# EasyEDA Pro project ProPrj_ESP32 Touchpad.epro, board PCB2
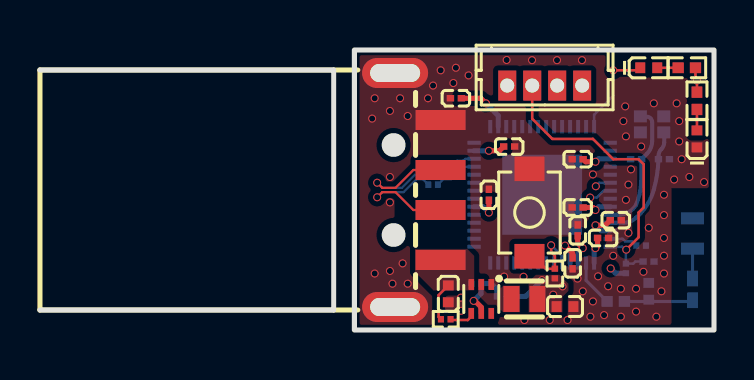
[diagram p9: board, top side]
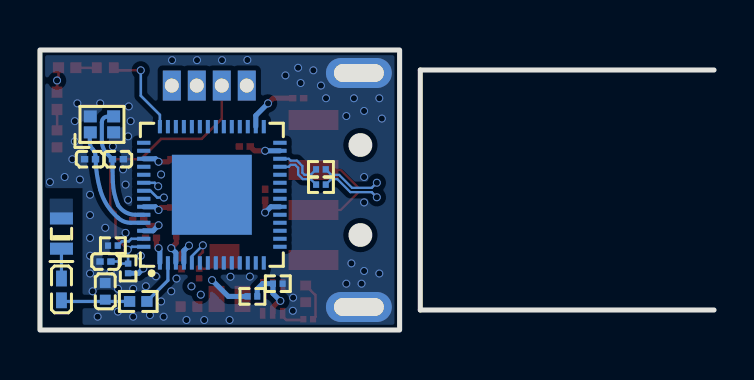
[diagram p10: board, bottom side, seen from below]

Outline 33.74 x 14 mm; copper layers: Top Layer, Inner1, Inner2, Bottom Layer. Coordinates in mm from the lower left corner of the outline.
Outline path: rectangle 15.74,14 33.74,0
Stack: Top Layer 0.035mm Outer layer thickness 1oz / Dielectric1 0.28mm 7628 RC49% 8.6mil / Inner1 0.035mm Inner layer thickness / Dielectric2 0.28mm 1.1mm H/HOZ Copper / Inner2 0.035mm Inner layer thickness / Dielectric3 0.28mm 7628 RC49% 8.6mil / Bottom Layer 0.035mm Outer layer thickness 1oz

## Design rules (mm)
net D-: D
net D+: D
net D_R+: D_R
net D_R-: D_R
spacing copperThickness1oz (default): track to track 0.102, other pairs 0.152 to 0.3
spacing copperThickness2oz: track to track 0.203, other pairs 0.152 to 0.3
track width copperThickness1oz (default): min 0.127, default 0.254, max 2.54
track width copperThickness2oz: min 0.203, default 0.254, max 2.54
differential pair differentialPair (default): width min 0.112, default 0.112, max 2.54; gap min 0.102, default 0.102
net GND uses copperRegion

## Placement (name value [footprint] x y rotation side)
ANT1  KH-1608-H08  [ANT-SMD_L1.7-W0.9]  32.66 4.82 270 bottom
C1  1.5pF  [C0402]  30.47 1.94 270 bottom
C2  22pF  [C0201]  31.23 8.54 0 bottom
C3  22pF  [C0201]  29.83 8.54 180 bottom
C4  1uF  [C0201]  20.82 11.59 180 top
C5  1uF  [C0201]  30.46 3.42 180 bottom
C6  100nF  [C0201]  22.47 6.76 90 top
C7  100nF  [C0201]  26.66 3.33 270 top
C8  100nF  [C0201]  26.91 4.98 90 top
C9  100nF  [C0201]  28.18 4.6 0 top
C10  100nF  [C0201]  28.82 5.49 0 top
C11  100nF  [C0201]  26.91 8.54 180 top
C12  100nF  [C0201]  26.91 6.13 180 top
C13  100nF  [C0201]  23.48 9.17 0 top
C14  22uF  [C0402]  26.28 1.17 180 top
C15  10uF  [C0402]  20.44 1.81 90 top
H1  WAFER-MX1.25-4PZZ  [CONN-TH_4P-P1.25_WAFER-MX1.25-4PZZ]  25.26 12.22 180 top
L1  10nH  [L0402-RD]  32.66 2.03 270 bottom
L2  2.2uH  [IND-SMD_L2.0-W1.2_FTC201210S]  24.25 1.55 0 top
LED1  NCD0402R1  [LED0402-RD]  30.47 13.11 0 top
LED2  NCD0402R1  [LED0402-RD]  32.88 9.56 90 top
R1  0Ω  [R0402_1]  28.82 1.43 180 bottom
R2  22Ω  [R0201]  19.67 7.27 180 bottom
R3  22Ω  [R0201]  19.67 8.03 180 bottom
R4  10kΩ  [R0201]  29.33 3.08 270 bottom
R5  10kΩ  [R0201]  25.77 2.82 270 top
R6  10kΩ  [R0201]  30.09 4.22 0 bottom
R7  10kΩ  [R0402]  32.37 13.11 0 top
R8  10kΩ  [R0402]  32.88 11.46 90 top
R9  10kΩ  [R0201]  20.31 0.54 180 top
R10  100kΩ  [R0201]  23.1 1.68 0 bottom
R11  22kΩ  [R0201]  21.83 2.32 0 bottom
SW1  TS342A2P 160gf 021  [KEY-SMD_L3.9-W3.0-LS5.0]  24.5 5.87 270 top
U1  2.4GHz  [QFN-56_L7.0-W7.0-P0.40-TL-EP4.6]  25.13 6.76 90 bottom
U2  TLV62585PDRLR  [SOT-563_L1.6-W1.2-P0.50-LS1.6-BL]  22.09 1.55 180 top
USB1  USB-U203-BDS  [USB-SMD_USB-U203-BDS]  18.91 7 270 top
X1  40MHz  [CRYSTAL-SMD_4P-L1.6-W1.2-BL]  30.63 10.28 180 bottom

## Footprints (pads in the part's own frame, mm; a bottom-side part is the same pattern mirrored in y, then rotated)
ANT-SMD_L1.7-W0.9
  rect 0.6x1.15 smd: 1(-0.756,0) 2(0.756,0)
C0201
  rect 0.368x0.324 smd: 1(-0.275,0) 2(0.275,0)
C0402
  rect 0.5x0.54 smd: 1(-0.42,0) 2(0.42,0)
CONN-TH_4P-P1.25_WAFER-MX1.25-4PZZ
  rect 0.9x1.5 hole 0.7: 1(1.875,0) 2(0.625,0) 3(-0.625,0) 4(-1.875,0)
CRYSTAL-SMD_4P-L1.6-W1.2-BL
  rect 0.65x0.6 smd: 1(-0.584,-0.4) 2(0.584,-0.4) 3(0.584,0.4) 4(-0.584,0.4)
IND-SMD_L2.0-W1.2_FTC201210S
  rect 0.8x1.3 smd: 1(-0.65,0) 2(0.65,0)
KEY-SMD_L3.9-W3.0-LS5.0
  rect 1.23x1.5 smd: 1(-2.185,0) 2(2.185,0)
L0402-RD
  rect 0.79x0.54 smd: 1(-0.545,0) 2(0.545,0)
LED0402-RD
  rect 0.5x0.54 smd: 1(-0.425,0) 2(0.425,0)
QFN-56_L7.0-W7.0-P0.40-TL-EP4.6
  rect 0.665x0.2 smd: 1(-3.408,2.6) 2(-3.408,2.2) 3(-3.408,1.8) 4(-3.408,1.4) 5(-3.408,1) 6(-3.408,0.6) 7(-3.408,0.2) 8(-3.408,-0.2) 9(-3.408,-0.6) 10(-3.408,-1) 11(-3.408,-1.4) 12(-3.408,-1.8) 13(-3.408,-2.2) 14(-3.408,-2.6) 29(3.408,-2.6) 30(3.408,-2.2) 31(3.408,-1.8) 32(3.408,-1.4) 33(3.408,-1) 34(3.408,-0.6) 35(3.408,-0.2) 36(3.408,0.2) 37(3.408,0.6) 38(3.408,1) 39(3.408,1.4) 40(3.408,1.8) 41(3.408,2.2) 42(3.408,2.6)
  rect 0.2x0.665 smd: 15(-2.6,-3.408) 16(-2.2,-3.408) 17(-1.8,-3.408) 18(-1.4,-3.408) 19(-1,-3.408) 20(-0.6,-3.408) 21(-0.2,-3.408) 22(0.2,-3.408) 23(0.6,-3.408) 24(1,-3.408) 25(1.4,-3.408) 26(1.8,-3.408) 27(2.2,-3.408) 28(2.6,-3.408) 43(2.6,3.408) 44(2.2,3.408) 45(1.8,3.408) 46(1.4,3.408) 47(1,3.408) 48(0.6,3.408) 49(0.2,3.408) 50(-0.2,3.408) 51(-0.6,3.408) 52(-1,3.408) 53(-1.4,3.408) 54(-1.8,3.408) 55(-2.2,3.408) 56(-2.6,3.408)
  rect 4x4 smd: 57(0,0)
R0201
  rect 0.303x0.324 smd: 1(-0.241,0) 2(0.241,0)
R0402
  rect 0.566x0.54 smd: 1(-0.433,0) 2(0.433,0)
R0402_1
  rect 0.566x0.54 smd: 1(-0.433,0) 2(0.433,0)
SOT-563_L1.6-W1.2-P0.50-LS1.6-BL
  rect 0.28x0.545 smd: 1(-0.5,-0.723) 2(0,-0.723) 3(0.5,-0.723) 4(0.5,0.723) 5(0,0.723) 6(-0.5,0.723)
USB-SMD_USB-U203-BDS
  rect 1x2.5 smd: 1(3.5,1.137) 2(1,1.137) 3(-1,1.137) 4(-3.5,1.137)
  oval 1.5x3.3 hole 0.9x2.5: 5(-5.85,-1.137) 6(5.85,-1.137)

## Nets
As in the schematic.

Pads without a net: ANT1 1; U1 6 7 8 9 10 11 12 13 14 15 16 17 18 19 21 22 23 24 28 29 31 32 33 34 35 36 37 38 39 40 41 43 44 46 47 50; U2 6

## Via types
v1: diameter 0.399, hole 0.305, Top Layer to Bottom Layer, 89 vias

## Routing (per net, layer and track width the routed paths; a pad name or vN(x,y) marks a point on that pad's centre or on a via; arc(x,y) is an arc through that point)
+3.3V: length 52.7
  Top Layer w0.127: R7.2 32.81,12.55 v1(32.88,12.48) R8.2
  Top Layer w0.254: C13.1 23,8.96 v1(22.47,8.96) ; v1(27.8,4.09) 27.91,4.2 C9.1 ; v1(27.8,6) 27.67,6.13 C12.1 ; v1(22.47,5.87) C6.1 ; v1(22.32,11.33) 22.07,11.59 C4.1 ; C11.1 27.31,8.41 v1(27.8,8.41) ; v1(26.28,4.22) 26.66,3.84 C7.1 ; v1(27.17,4.09) 26.91,4.35 C8.1 ; v1(27.8,5.24) 28.29,5.24 C10.1
  Inner2 w0.254: v1(27.8,8.41) 27.8,11.29 28.99,12.48 v1(32.88,12.48) ; v1(28.56,3.08) 28.18,3.46 28.18,3.71 v1(27.8,4.09)
  Inner2 w0.508: 26.16,2.81 26.09,2.81 25.59,3.31 ; 26.16,2.81 v1(26.16,2.18) 25.74,1.77 v1(25.69,1.77) ; 26.16,2.81 26.16,3.31 ; 26.16,3.55 26.7,4.09 ; 26.16,3.55 26.16,3.31 ; 26.16,3.55 26.16,3.88 ; 26.7,4.09 26.41,4.09 v1(26.28,4.22) 26.19,4.13 26.19,3.99 ; 26.7,4.09 v1(27.17,4.09) ; 27.8,4.73 27.8,4.73 v1(27.17,4.09) ; 27.8,4.73 v1(27.8,4.09) v1(27.17,4.09) ; 27.8,4.73 v1(27.8,5.24) v1(27.8,6) 27.9,6 28.44,6.55 28.44,7.9 27.93,8.41 v1(27.8,8.41) ; 26.19,3.99 26.16,3.95 26.16,3.88 ; 26.19,3.99 26.19,3.92 26.16,3.88 ; 26.16,3.31 25.59,3.31 ; 25.59,3.31 23.76,3.31 22.47,4.6 v1(22.47,5.87) v1(22.47,8.96) 22.47,11.19 v1(22.32,11.33) ; 25.59,3.31 26.16,3.88
  Bottom Layer w0.254: U1.30 22.94,10.72 v1(22.32,11.33) ; U1.1 27.73,4.03 v1(27.8,4.09) ; U1.27 v1(22.47,8.96) ; U1.3 26.94,3.86 v1(27.17,4.09) ; v1(26.28,4.22) 26.53,3.96 U1.4 ; R4.2 28.81,2.84 v1(28.56,3.08) ; R10.2 24.31,1.68 v1(25.13,2.49) ; v1(27.8,5.24) 28.08,4.96 U1.54 ; U1.51 27.96,6.16 v1(27.8,6) ; U1.20 22.18,6.16 v1(22.47,5.87) ; U1.45 27.95,8.56 v1(27.8,8.41)
+5V: length 1.9
  Top Layer w0.127: C15.2 19.95,1.74 19.95,0.66 R9.2
GND:
  vias: v1(16.63,10.57) v1(16.75,11.59) v1(16.75,2.82) v1(17.51,10.95) v1(17.51,7.65) v1(17.51,6.38) v1(17.51,2.95) v1(17.64,2.32) v1(18.02,11.59) v1(18.15,3.33) v1(18.4,10.7) v1(18.4,2.32) v1(19.42,11.59) v1(19.67,12.22) v1(20.06,12.98) v1(20.69,12.35) v1(20.82,13.11) v1(21.07,1.62) v1(21.08,0.96) v1(21.45,12.73) v1(23.23,2.67) v1(23.36,13.5) v1(24.2,2.66) v1(24.25,0.5) v1(24.63,13.49) v1(25.52,0.5) v1(25.88,13.49) v1(26.41,0.5) v1(26.91,2.57) v1(27.13,13.49) v1(27.17,1.94) v1(27.55,0.67) v1(27.67,7.78) v1(27.67,1.43) v1(27.93,2.68) v1(28.23,0.74) v1(28.44,2.19) v1(28.69,3.71) v1(29.07,2.06) v1(29.07,0.67) v1(29.2,10.44) v1(29.29,11.18) v1(29.33,9.68) v1(29.33,6.51) v1(29.45,7.27) v1(29.45,4.86) v1(29.58,8.03) v1(29.83,2.06) v1(29.83,0.92) v1(30.09,9.17) v1(30.2,2.91) v1(30.47,5.11) v1(30.72,11.33) v1(30.85,0.67) v1(31.1,1.94) v1(31.23,6.76) v1(31.23,5.75) v1(31.23,4.6) v1(31.23,3.71) v1(31.23,2.82) v1(31.74,7.52) v1(31.87,11.33) v1(31.99,10.44) v1(31.99,9.43) v1(32.12,8.54) v1(32.5,7.65) v1(33.24,7.4)
CONN: length 4.6
  Top Layer w0.127: v1(28.69,12.98) 29.92,12.98 LED1.1
  Bottom Layer w0.127: v1(28.69,12.98) 28.69,11.71 27.73,10.76 U1.42
D+: length 2.5
  Bottom Layer w0.112: R3.1 20.19,7.76 20.5,7.76 20.6,7.87 20.6,8.2 20.87,8.47 21.19,8.47 21.28,8.56 U1.26
D-: length 2.5
  Bottom Layer w0.112: U1.25 21.28,8.16 21.19,8.25 20.96,8.25 20.82,8.11 20.82,7.78 20.58,7.54 20.19,7.54 R2.1
D_R+: length 6.7
  Top Layer w0.112: v1(16.88,7.36) 17.13,7.11 17.79,7.11 18.69,8 USB1.3
  Bottom Layer w0.112: R3.2 19.16,7.76 18.76,7.76 18.11,7.11 17.13,7.11 v1(16.88,7.36)
D_R-: length 6.7
  Top Layer w0.112: USB1.2 18.69,6 17.79,6.89 17.13,6.89 v1(16.88,6.64)
  Bottom Layer w0.112: v1(16.88,6.64) 17.13,6.89 18.2,6.89 18.85,7.54 19.16,7.54 R2.2
ESP32_EN: length 15.2
  Top Layer w0.127: v1(29.34,4.02) 29.96,4.63 29.96,5.87 30.22,6.13 30.22,8.28 29.96,8.54 28.69,8.54 27.67,9.56 25.64,9.56 24.64,10.56 H1.2
  Bottom Layer w0.127: U1.56 29.13,4.16 29.33,3.97 R4.1 29.69,3.32 29.8,3.42 C5.2
ESP32_GPIO0: length 13.7
  Top Layer w0.127: v1(25.58,4.24) 25.58,3.9 25.77,3.71 R5.1 25.77,3.06 25.32,3.06 24.69,3.69 SW1.2
  Inner2 w0.127: v1(25.58,4.24) 24.1,4.24 23.39,4.95 H1.1
  Bottom Layer w0.127: U1.5 26.13,3.69 25.59,4.24 v1(25.58,4.24)
ESP32_XI: length 6
  Bottom Layer w0.203: 31.24,9.83 31.24,9.39 arc(31.21,9.2) 31.1,9.05 arc(31,8.88) 30.96,8.69 C2.1 ; C2.1 30.96,8.45 ; C2.1 arc(30.89,7.77) 30.72,7.02 arc(30.38,6.25) 29.83,5.62 arc(29.54,5.43) 29.2,5.36 U1.53
ESP32_XO: length 6.3
  Bottom Layer w0.203: U1.52 28.96,5.76 arc(29.46,5.89) 29.83,6.25 arc(30.01,6.81) 30.09,7.4 arc(30.1,7.97) C3.1 30.37,8.81 arc(30.57,9.1) 30.64,9.45 30.64,10.39 arc(30.56,10.59) 30.36,10.67
FB: length 3.1
  Top Layer w0.254: U2.5 22.09,1.14 21.77,1.46 v1(21.71,1.46)
  Bottom Layer w0.254: R10.1 22.86,2.05 22.59,2.32 R11.2 22.07,1.82 v1(21.71,1.46)
LNA_IN: length 2.4
  Bottom Layer w0.158: R1.2 27.34,2.48 U1.2
RX: length 7.4
  Inner2 w0.127: H1.3 25.89,10.83 26.91,9.81 26.91,7.25 v1(27.53,6.62)
  Bottom Layer w0.127: U1.49 28.21,6.96 27.87,6.62 v1(27.53,6.62)
TX: length 6.4
  Inner2 w0.127: H1.4 27.14,7.43 27.38,7.19 v1(27.82,7.19)
  Bottom Layer w0.127: U1.48 28,7.36 v1(27.82,7.19)
$1N8: length 1.5
  Bottom Layer w0.158: L1.1 ANT1.2
$1N9: length 3.4
  Bottom Layer w0.158: L1.2 32.6,1.43 R1.1
$1N50: length 1.4
  Bottom Layer w0.127: R6.1 29.63,4.43 29.29,4.43 29.16,4.56 U1.55
$1N55: length 1
  Top Layer w0.127: LED1.2 R7.1
$1N60: length 1
  Top Layer w0.127: 32.88,11.03 LED2.2
$1N70: length 1.3
  Top Layer w0.127: R9.1 20.59,0.5 21.41,0.5 21.59,0.67 U2.4

## Copper pours and planes (outline as drawn; the poured copper is in the pictures)
+3.3V on Top Layer: 24.45,2.76 26.45,2.76 26.45,0.86 24.45,0.86
+5V on Top Layer: 18.77,4.05 21.73,4.05 21.73,1.98 18.77,1.98
GND on Top Layer: 15.74,14 33.74,14 33.74,0 15.74,0
GND on Bottom Layer: 15.74,14 33.74,14 33.74,0 15.74,0
GND on Inner1: 15.99,13.74 33.48,13.74 33.48,0.26 15.99,0.26
GND on Inner2: 15.74,14 33.74,14 33.74,0 15.74,0
(no net) on Bottom Layer: 32.09,6.57 33.25,6.57 33.25,5.27 32.09,5.27
SW on Top Layer: 21.94,2.56 24.03,2.56 24.03,0.89 21.94,0.89

Small or netless copper shapes (teardrops, artwork), in the pictures only: 5 on Inner1
